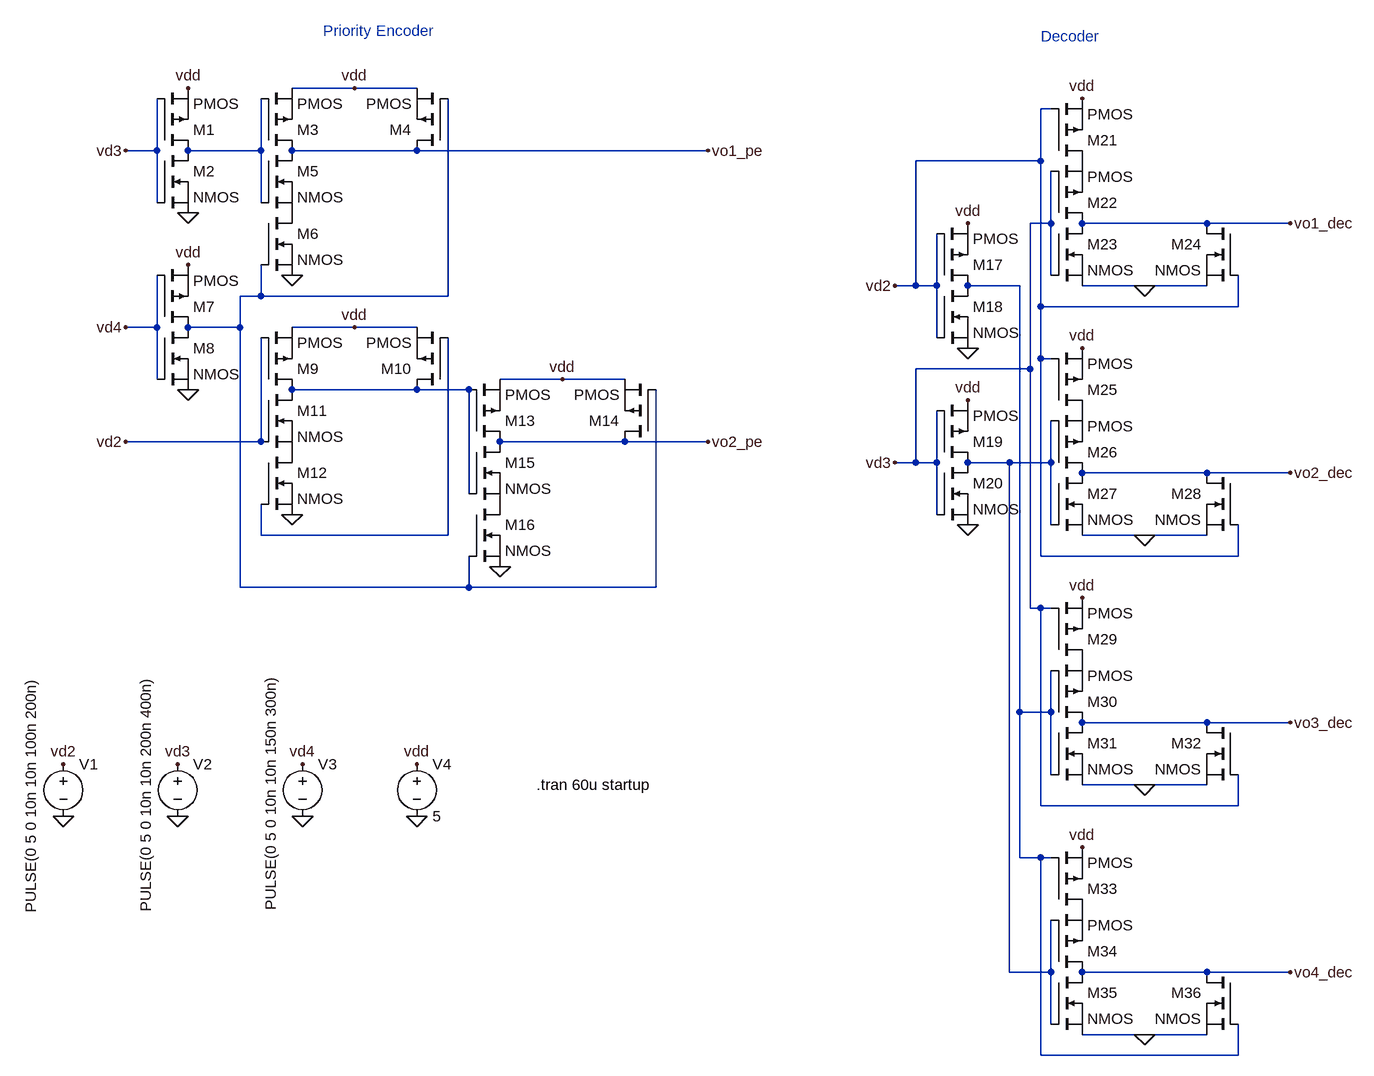
[diagram p0: schematic Encoder Decoder.asc]
Encoder Decoder.asc, the LTspice schematic file:
Version 4.1
SHEET 1 2868 1556
WIRE 464 64 368 64
WIRE 560 64 464 64
WIRE 1536 96 1520 96
WIRE 160 160 160 80
WIRE 160 160 112 160
WIRE 320 160 320 80
WIRE 320 160 208 160
WIRE 560 160 368 160
WIRE 1008 160 560 160
WIRE 1520 176 1520 96
WIRE 1520 176 1328 176
WIRE 160 240 160 160
WIRE 320 240 320 160
WIRE 1536 272 1536 192
WIRE 1536 272 1504 272
WIRE 1776 272 1584 272
WIRE 1904 272 1776 272
WIRE 1536 352 1536 272
WIRE 1328 368 1328 176
WIRE 1328 368 1296 368
WIRE 1360 368 1360 288
WIRE 1360 368 1328 368
WIRE 1488 368 1408 368
WIRE 1680 368 1584 368
WIRE 1776 368 1680 368
WIRE 320 384 320 336
WIRE 320 384 288 384
WIRE 608 384 608 80
WIRE 608 384 320 384
WIRE 1520 400 1520 176
WIRE 1824 400 1824 352
WIRE 1824 400 1520 400
WIRE 160 432 160 352
WIRE 160 432 112 432
WIRE 288 432 288 384
WIRE 288 432 208 432
WIRE 464 432 368 432
WIRE 560 432 464 432
WIRE 1360 448 1360 368
WIRE 1520 480 1520 400
WIRE 1536 480 1520 480
WIRE 1504 496 1504 272
WIRE 1504 496 1328 496
WIRE 160 512 160 432
WIRE 784 512 688 512
WIRE 880 512 784 512
WIRE 560 528 368 528
WIRE 640 528 560 528
WIRE 320 608 320 448
WIRE 320 608 112 608
WIRE 880 608 688 608
WIRE 1008 608 880 608
WIRE 1328 640 1328 496
WIRE 1328 640 1296 640
WIRE 1360 640 1360 560
WIRE 1360 640 1328 640
WIRE 1472 640 1408 640
WIRE 1536 640 1536 576
WIRE 1536 640 1472 640
WIRE 1776 656 1584 656
WIRE 1904 656 1776 656
WIRE 640 688 640 528
WIRE 1360 720 1360 640
WIRE 1536 736 1536 640
WIRE 320 752 320 704
WIRE 608 752 608 448
WIRE 608 752 320 752
WIRE 1680 752 1584 752
WIRE 1776 752 1680 752
WIRE 1520 784 1520 480
WIRE 1824 784 1824 736
WIRE 1824 784 1520 784
WIRE 288 832 288 432
WIRE 640 832 640 784
WIRE 640 832 288 832
WIRE 928 832 928 528
WIRE 928 832 640 832
WIRE 1504 864 1504 496
WIRE 1520 864 1504 864
WIRE 1536 864 1520 864
WIRE 1488 1024 1488 368
WIRE 1536 1024 1536 960
WIRE 1536 1024 1488 1024
WIRE 1776 1040 1584 1040
WIRE 1904 1040 1776 1040
WIRE 1536 1120 1536 1024
WIRE 1680 1136 1584 1136
WIRE 1776 1136 1680 1136
WIRE 1520 1168 1520 864
WIRE 1824 1168 1824 1120
WIRE 1824 1168 1520 1168
WIRE 1488 1248 1488 1024
WIRE 1520 1248 1488 1248
WIRE 1536 1248 1520 1248
WIRE 1472 1424 1472 640
WIRE 1536 1424 1536 1344
WIRE 1536 1424 1472 1424
WIRE 1776 1424 1584 1424
WIRE 1904 1424 1776 1424
WIRE 1536 1504 1536 1424
WIRE 1680 1520 1584 1520
WIRE 1776 1520 1680 1520
WIRE 1520 1552 1520 1248
WIRE 1824 1552 1824 1504
WIRE 1824 1552 1520 1552
FLAG 208 256 0
FLAG 208 64 vdd
FLAG 368 352 0
FLAG 464 64 vdd
FLAG 208 528 0
FLAG 208 336 vdd
FLAG 368 720 0
FLAG 464 432 vdd
FLAG 688 800 0
FLAG 784 512 vdd
FLAG 112 160 vd3
FLAG 112 432 vd4
FLAG 112 608 vd2
FLAG 1008 160 vo1_pe
FLAG 1008 608 vo2_pe
FLAG 16 1184 0
FLAG 192 1184 0
FLAG 384 1184 0
FLAG 560 1184 0
FLAG 16 1104 vd2
FLAG 192 1104 vd3
FLAG 384 1104 vd4
FLAG 560 1104 vdd
FLAG 1408 464 0
FLAG 1408 272 vdd
FLAG 1408 736 0
FLAG 1408 544 vdd
FLAG 1680 368 0
FLAG 1584 80 vdd
FLAG 1680 752 0
FLAG 1584 464 vdd
FLAG 1680 1136 0
FLAG 1584 848 vdd
FLAG 1680 1520 0
FLAG 1584 1232 vdd
FLAG 1904 272 vo1_dec
FLAG 1904 656 vo2_dec
FLAG 1904 1040 vo3_dec
FLAG 1904 1424 vo4_dec
FLAG 1296 368 vd2
FLAG 1296 640 vd3
SYMBOL pmos 160 160 M180
SYMATTR InstName M1
SYMBOL nmos 160 160 R0
SYMATTR InstName M2
SYMBOL pmos 320 160 M180
SYMATTR InstName M3
SYMBOL pmos 608 160 R180
SYMATTR InstName M4
SYMBOL nmos 320 160 R0
SYMATTR InstName M5
SYMBOL nmos 320 256 R0
SYMATTR InstName M6
SYMBOL pmos 160 432 M180
SYMATTR InstName M7
SYMBOL nmos 160 432 R0
SYMATTR InstName M8
SYMBOL pmos 320 528 M180
SYMATTR InstName M9
SYMBOL pmos 608 528 R180
SYMATTR InstName M10
SYMBOL nmos 320 528 R0
SYMATTR InstName M11
SYMBOL nmos 320 624 R0
SYMATTR InstName M12
SYMBOL pmos 640 608 M180
SYMATTR InstName M13
SYMBOL pmos 928 608 R180
SYMATTR InstName M14
SYMBOL nmos 640 608 R0
SYMATTR InstName M15
SYMBOL nmos 640 704 R0
SYMATTR InstName M16
SYMBOL voltage 16 1088 R0
WINDOW 3 -50 -119 VRight 2
WINDOW 123 0 0 Left 0
WINDOW 39 0 0 Left 0
SYMATTR InstName V1
SYMATTR Value PULSE(0 5 0 10n 10n 100n 200n)
SYMBOL voltage 192 1088 R0
WINDOW 3 -49 -121 VRight 2
WINDOW 123 0 0 Left 0
WINDOW 39 0 0 Left 0
SYMATTR InstName V2
SYMATTR Value PULSE(0 5 0 10n 10n 200n 400n)
SYMBOL voltage 384 1088 R0
WINDOW 3 -49 -123 VRight 2
WINDOW 123 0 0 Left 0
WINDOW 39 0 0 Left 0
SYMATTR InstName V3
SYMATTR Value PULSE(0 5 0 10n 10n 150n 300n)
SYMBOL voltage 560 1088 R0
WINDOW 123 0 0 Left 0
WINDOW 39 0 0 Left 0
SYMATTR InstName V4
SYMATTR Value 5
SYMBOL pmos 1360 368 M180
SYMATTR InstName M17
SYMBOL nmos 1360 368 R0
SYMATTR InstName M18
SYMBOL pmos 1360 640 M180
SYMATTR InstName M19
SYMBOL nmos 1360 640 R0
SYMATTR InstName M20
SYMBOL pmos 1536 176 M180
SYMATTR InstName M21
SYMBOL pmos 1536 272 M180
SYMATTR InstName M22
SYMBOL nmos 1536 272 R0
SYMATTR InstName M23
SYMBOL nmos 1824 272 M0
SYMATTR InstName M24
SYMBOL pmos 1536 560 M180
SYMATTR InstName M25
SYMBOL pmos 1536 656 M180
SYMATTR InstName M26
SYMBOL nmos 1536 656 R0
SYMATTR InstName M27
SYMBOL nmos 1824 656 M0
SYMATTR InstName M28
SYMBOL pmos 1536 944 M180
SYMATTR InstName M29
SYMBOL pmos 1536 1040 M180
SYMATTR InstName M30
SYMBOL nmos 1536 1040 R0
SYMATTR InstName M31
SYMBOL nmos 1824 1040 M0
SYMATTR InstName M32
SYMBOL pmos 1536 1328 M180
SYMATTR InstName M33
SYMBOL pmos 1536 1424 M180
SYMATTR InstName M34
SYMBOL nmos 1536 1424 R0
SYMATTR InstName M35
SYMBOL nmos 1824 1424 M0
SYMATTR InstName M36
TEXT 744 1136 Left 2 !.tran 60u startup
TEXT 416 -24 Left 2 ;Priority Encoder
TEXT 1520 -16 Left 2 ;Decoder

The netlist it stands for:
* Encoder Decoder.asc
M1 N001 vd3 vdd vdd PMOS
M2 N001 vd3 0 0 NMOS
M3 vo1_pe N001 vdd vdd PMOS
M4 vo1_pe N003 vdd vdd PMOS
M5 vo1_pe N001 P001 P001 NMOS
M6 P001 N003 0 0 NMOS
M7 N003 vd4 vdd vdd PMOS
M8 N003 vd4 0 0 NMOS
M9 N004 vd2 vdd vdd PMOS
M10 N004 N006 vdd vdd PMOS
M11 N004 vd2 P002 P002 NMOS
M12 P002 N006 0 0 NMOS
M13 vo2_pe N004 vdd vdd PMOS
M14 vo2_pe N003 vdd vdd PMOS
M15 vo2_pe N004 P003 P003 NMOS
M16 P003 N003 0 0 NMOS
V1 vd2 0 PULSE(0 5 0 10n 10n 100n 200n)
V2 vd3 0 PULSE(0 5 0 10n 10n 200n 400n)
V3 vd4 0 PULSE(0 5 0 10n 10n 150n 300n)
V4 vdd 0 5
M17 N002 vd2 vdd vdd PMOS
M18 N002 vd2 0 0 NMOS
M19 N005 vd3 vdd vdd PMOS
M20 N005 vd3 0 0 NMOS
M21 P004 vd2 vdd vdd PMOS
M22 vo1_dec vd3 P004 P004 PMOS
M23 vo1_dec vd3 0 0 NMOS
M24 vo1_dec vd2 0 0 NMOS
M25 P005 vd2 vdd vdd PMOS
M26 vo2_dec N005 P005 P005 PMOS
M27 vo2_dec N005 0 0 NMOS
M28 vo2_dec vd2 0 0 NMOS
M29 P006 vd3 vdd vdd PMOS
M30 vo3_dec N002 P006 P006 PMOS
M31 vo3_dec N002 0 0 NMOS
M32 vo3_dec vd3 0 0 NMOS
M33 P007 N002 vdd vdd PMOS
M34 vo4_dec N005 P007 P007 PMOS
M35 vo4_dec N005 0 0 NMOS
M36 vo4_dec N002 0 0 NMOS
.model NMOS NMOS
.model PMOS PMOS
.lib standard.mos
.tran 60u startup
* Priority Encoder
* Decoder
.backanno
.end